# EAGLE design dash8_40cw (EAGLE 9.5.2)
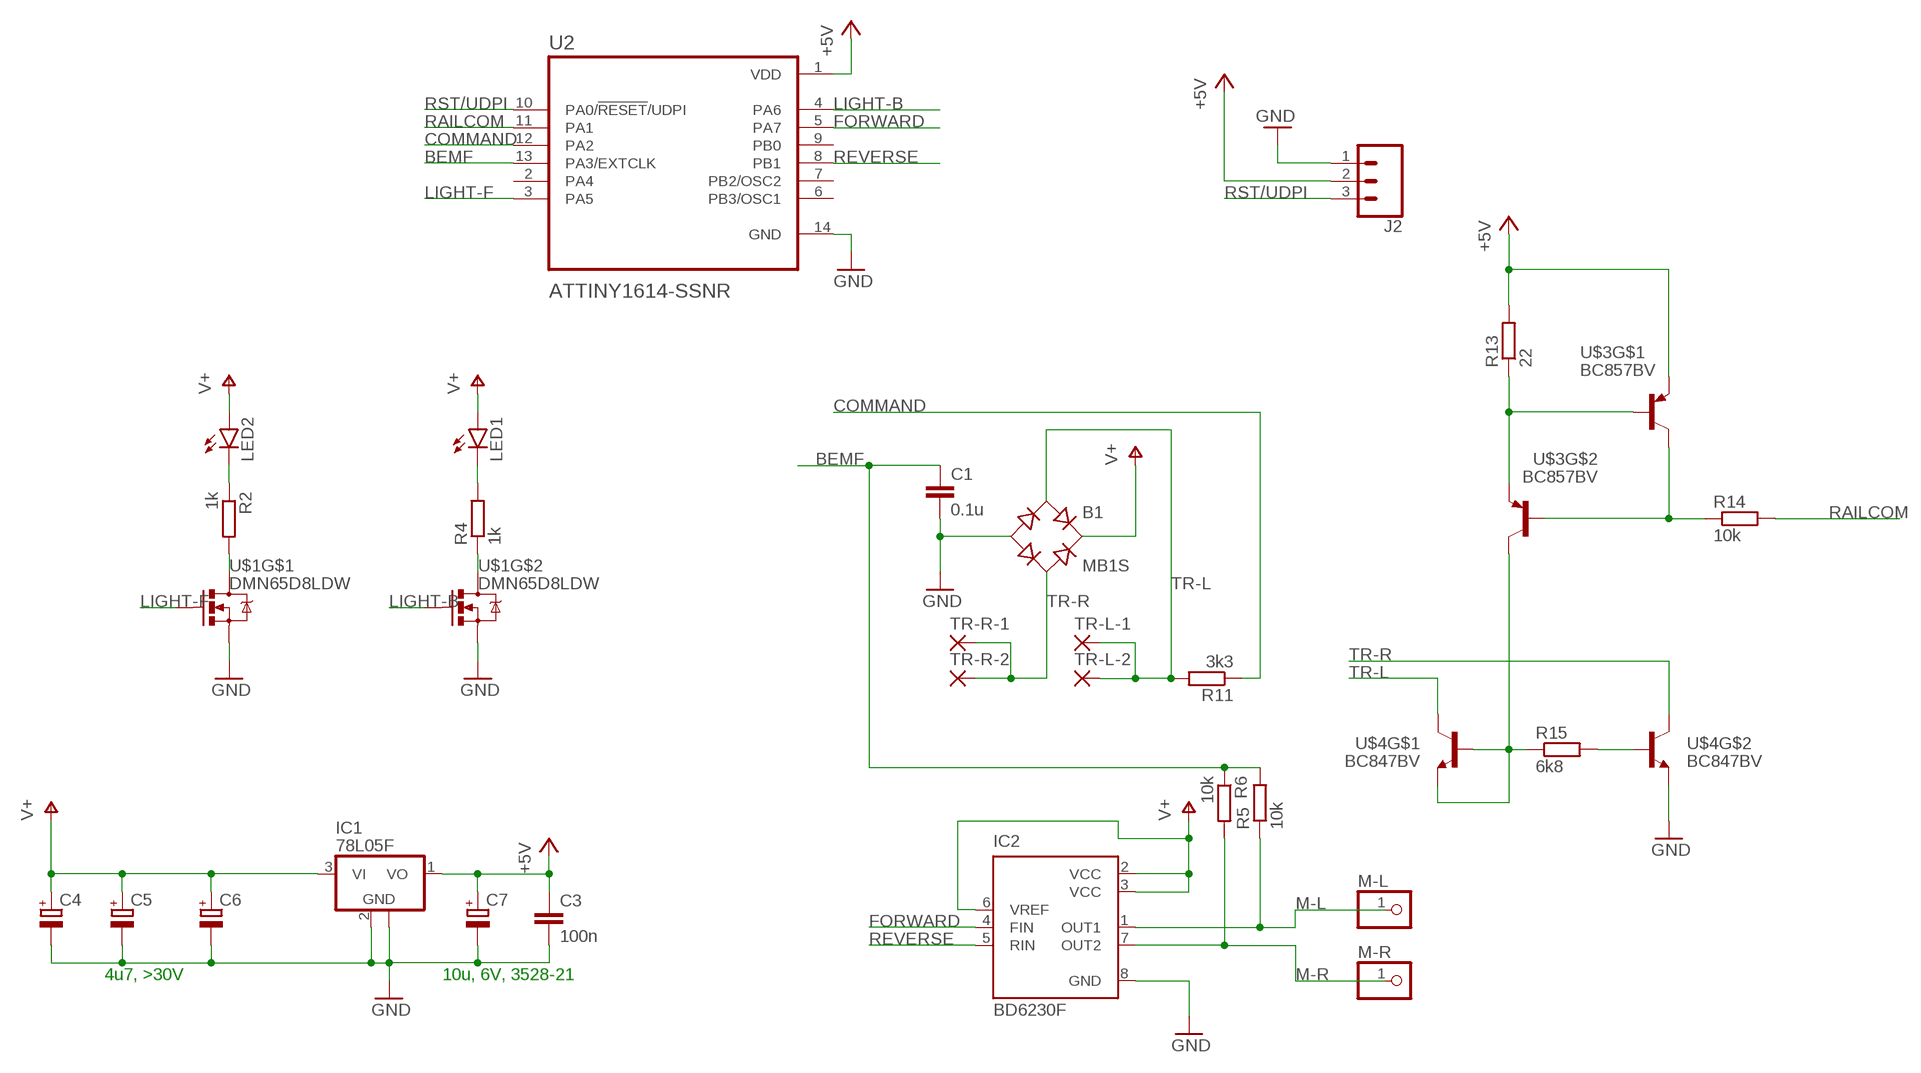
[diagram p0: schematic, sheet 1]

## Parts
B1  MB1S  [SOIC-4]
C1  0.1u  C-EUC0805  [C0805]
C3  100n  C-EUC0805  [C0805]
C4  CPOL-EUCT3528  [CT3528]
C5  CPOL-EUCT3528  [CT3528]
C6  CPOL-EUCT3528  [CT3528]
C7  CPOL-EUCT3528  [CT3528]
IC1  78L05F  [SOT89]
IC2  BD6230F  [SOP8]
J2  455-1750-1-ND  CONN_03  [1X03]
LED1  LED3MM  [LED3MM]
LED2  LED3MM  [LED3MM]
M-L  PINHD-1X1  [1X01]
M-R  PINHD-1X1  [1X01]
R2  1k  R-EU_R0603  [R0603]
R4  1k  R-EU_R0603  [R0603]
R5  10k  R-EU_R0603  [R0603]
R6  10k  R-EU_R0603  [R0603]
R11  3k3  R-EU_R0603  [R0603]
R13  22  R-EU_R0805  [R0805]
R14  10k  R-EU_R0805  [R0805]
R15  6k8  R-EU_R0805  [R0805]
TR-L-1  SMD5  [SMD2,54-5,08]
TR-L-2  SMD5  [SMD2,54-5,08]
TR-R-1  SMD5  [SMD2,54-5,08]
TR-R-2  SMD5  [SMD2,54-5,08]
U2  ATTINY1614-SSNR  [SOIC127P600X175-14N]
U$1  DMN65D8LDW  [SOT363]
U$3  BC857BV  [SOT-666]
U$4  BC847BV  [SOT-666]

## Nets
+5V: C3.1 C7.+ IC1.1(VO) J2.2 R13.2 U2.1(VDD) U$3.P$1(E)
BEMF: C1.1 R5.2 R6.1 U2.13(PA3/EXTCLK)
COMMAND: R11.1 U2.12(PA2)
FORWARD: IC2.4(FIN) U2.5(PA7)
GND: B1.- C1.2 C3.2 C4.- C5.- C6.- C7.- IC1.2(GND) IC1.2@1(GND) IC2.8(GND) J2.1 U2.14(GND) U$1.P$3(S) U$1.P$6(S) U$4.P$4(E)
LIGHT-B: U2.4(PA6) U$1.P$5(G)
LIGHT-F: U2.3(PA5) U$1.P$2(G)
M-L: IC2.1(OUT1) M-L.1 R5.1
M-R: IC2.7(OUT2) M-R.1 R6.2
N$1: LED2.K(C) R2.1
N$5: R4.1 U$1.P$1(D)
N$6: R2.2 U$1.P$4(D)
N$7: LED1.K(C) R4.2
N$18: R15.2 U$4.P$5(B)
N$19: R15.1 U$3.P$3(C) U$4.P$1(E) U$4.P$2(B)
N$20: R13.1 U$3.P$2(B) U$3.P$4(E)
N$21: R14.1 U$3.P$5(B) U$3.P$6(C)
RAILCOM: R14.2 U2.11(PA1)
REVERSE: IC2.5(RIN) U2.8(PB1)
RST/UDPI: J2.3 U2.10(PA0/!RESET!/UDPI)
TR-L: B1.~1(AC1) R11.2 TR-L-1.1(P) TR-L-2.1(P) U$4.P$6(C)
TR-R: B1.~2(AC2) TR-R-1.1(P) TR-R-2.1(P) U$4.P$3(C)
V+: B1.+ C4.+ C5.+ C6.+ IC1.3(VI) IC2.2(VCC) IC2.3(VCC) IC2.6(VREF) LED1.A LED2.A
Unconnected: U2.2(PA4) U2.6(PB3/OSC1) U2.7(PB2/OSC2) U2.9(PB0)

## Notes on the sheet
- 4u7, >30V | 10u, 6V, 3528-21

## Library data of the parts
B1 = rectifier:MB*S: Bridge Rectifier Source: http://www.fairchildsemi.com/ds/MB/MB6S.pdf
C1 = resistor:C-EU: CAPACITOR, European symbol
C3 = rcl:C-EU: CAPACITOR, European symbol; SPICEPREFIX: C
C4-C7 = rcl:CPOL-EU: POLARIZED CAPACITOR, European symbol; SPICEPREFIX: C
IC1 = linear:78L*: POSITOIV-VOLTAGE REGULATORS Output up to 100 mA Source: Datasheet <http://focus.ti.com/lit/ds/symlink/ua78l05.pdf>
IC2 = rohm:BD623*F: H-bridge driver for brush motors Source: http://www.rohm.com/products/databook/motor/pdf/bd623x_series-e.pdf; MPN: BD6230F-E2; OC_FARNELL: 1716264; OC_NEWARK: 15R0529
J2 = SparkFun-Connectors:CONN_03: Multi connection point. Often used as Generic Header-pin footprint for 0.1 inch spaced/style header connections On any of the 0.1 inch spaced packages, you can populate with these: Break Away Headers - Straight <https://www.sparkfun.com/products/116> (PRT-00116) Break Away Male Headers - Right Angle <https://www.sparkfun.com/products/553> (PRT-00553) Female Headers <https://www.sparkfun.com/products/115> (PRT-00115) Break Away Headers - Machine Pin <https://www.sparkfun.com/products/117> (PRT-00117) Break Away Female Headers - Swiss Machine Pin <https://www.sparkfun.com/products/743> (PRT-00743) Stackable Header - 3 Pin (Female, 0.1") <https://www.sparkfun.com/products/13875> (PRT-13875) For SCREWTERMINALS and SPRING TERMINALS visit here: Screw Terimnals on SparkFun.com <https://www.sparkfun.com/search/results?term=Screw+Terminals> (5mm/3.5mm/2.54mm spacing) This device is also useful as a general connection point to wire up your design to another part of your project. Our various solder wires solder well into these plated through hole pads. Hook-Up Wire - Assortment (Stranded, 22 AWG) <https://www.sparkfun.com/products/11375> (PRT-11375) Hook-Up Wire - Assortment (Solid Core, 22 AWG) <https://www.sparkfun.com/products/11367> (PRT-11367) View the entire wire category on our website here <https://www.sparkfun.com/categories/141> Special notes: Molex polarized connector foot print use with SKU : PRT-08232 with associated crimp pins and housings.; PROD_ID: XXX-00000
LED1 LED2 = led:LED: LED OSRAM: - CHIPLED LG R971, LG N971, LY N971, LG Q971, LY Q971, LO R971, LY R971 LH N974, LH R974 LS Q976, LO Q976, LY Q976 LO Q996 - Hyper CHIPLED LW Q18S LB Q993, LB Q99A, LB R99A - SideLED LS A670, LO A670, LY A670, LG A670, LP A670 LB A673, LV A673, LT A673, LW A673 LH A674 LY A675 LS A676, LA A676, LO A676, LY A676, LW A676 LS A679, LY A679, LG A679 - Hyper Micro SIDELED® LS Y876, LA Y876, LO Y876, LY Y876 LT Y87S - SmartLED LW L88C, LW L88S LB L89C, LB L89S, LG L890 LS L89K, LO L89K, LY L89K LS L896, LA L896, LO L896, LY L896 - TOPLED LS T670, LO T670, LY T670, LG T670, LP T670 LSG T670, LSP T670, LSY T670, LOP T670, LYG T670 LG T671, LOG T671, LSG T671 LB T673, LV T673, LT T673, LW T673 LH T674 LS T676, LA T676, LO T676, LY T676, LB T676, LH T676, LSB T676, LW T676 LB T67C, LV T67C, LT T67C, LS T67K, LO T67K, LY T67K, LW E67C LS E67B, LA E67B, LO E67B, LY E67B, LB E67C, LV E67C, LT E67C LW T67C LS T679, LY T679, LG T679 LS T770, LO T770, LY T770, LG T770, LP T770 LB T773, LV T773, LT T773, LW T773 LH T774 LS E675, LA E675, LY E675, LS T675 LS T776, LA T776, LO T776, LY T776, LB T776 LHGB T686 LT T68C, LB T68C - Hyper Mini TOPLED® LB M676 - Mini TOPLED Santana® LG M470 LS M47K, LO M47K, LY M47K Source: http://www.osram.convergy.de LUXEON: - LUMILED® LXK2-PW12-R00, LXK2-PW12-S00, LXK2-PW14-U00, LXK2-PW14-V00 LXK2-PM12-R00, LXK2-PM12-S00, LXK2-PM14-U00 LXK2-PE12-Q00, LXK2-PE12-R00, LXK2-PE12-S00, LXK2-PE14-T00, LXK2-PE14-U00 LXK2-PB12-K00, LXK2-PB12-L00, LXK2-PB12-M00, LXK2-PB14-N00, LXK2-PB14-P00, LXK2-PB14-Q00 LXK2-PR12-L00, LXK2-PR12-M00, LXK2-PR14-Q00, LXK2-PR14-R00 LXK2-PD12-Q00, LXK2-PD12-R00, LXK2-PD12-S00 LXK2-PH12-R00, LXK2-PH12-S00 LXK2-PL12-P00, LXK2-PL12-Q00, LXK2-PL12-R00 Source: www.luxeon.com KINGBRIGHT: KA-3528ASYC Source: www.kingbright.com
M-L M-R = adafruit:PINHD-1X1: Pin header 1x1 for 0.1" spacing With round pins
R2 R4-R6 R11 R13-R15 = rcl:R-EU_: RESISTOR, European symbol; SPICEPREFIX: R
TR-L-1 TR-L-2 TR-R-1 TR-R-2 = wirepad:SMD5: SMD PAD
U2 = ATTINY1614-SSNR:ATTINY1614-SSNR: 20MHz, SOIC, 85C, Green, 14 SOIC .150in T/R; AVAILABILITY: Unavailable; DESCRIPTION: AVR tinyAVR™ 1 Microcontroller IC 8-Bit 20MHz 16KB _16K x 8_ FLASH 14-SOIC; MF: Microchip; MP: ATTINY1614-SSNR; PACKAGE: SO-14 Microchip; PRICE: None
U$1 = Railstars:DMN65D8LDW
U$3 = Railstars:BC857BV
U$4 = Railstars:BC847BV

## Board
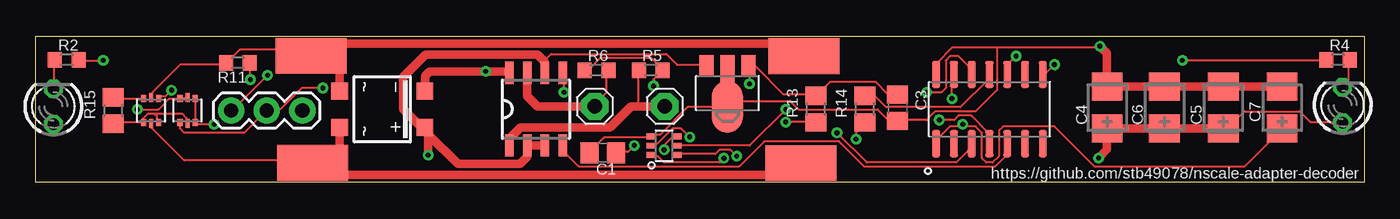
[diagram p1: board, top side]
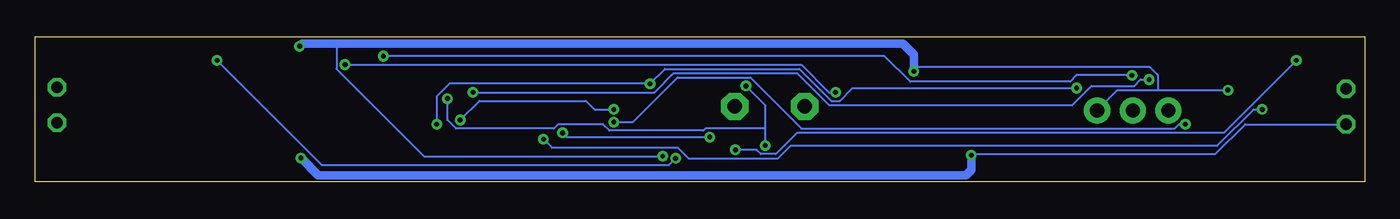
[diagram p2: board, bottom side, seen from below]

Size 95 x 10.4 mm. Coordinates in mm from the lower left corner, seen from the top.
Outline: 0,0 95,0 95,10.4 0,10.4 0,0
Copper layers (1*16): Top 0.035mm / dielectric 1.5mm / Bottom 0.035mm
Design rules "default *": minimum track width 6mil, minimum drill 0.35mm, track to track 6mil, track to pad 6mil, pad to pad 6mil, via to via 6mil, smd to smd 6mil, copper to edge 6mil, drill to drill 6mil, minimum pad ring 10mil, minimum via ring 8mil, stop-mask expansion 4mil, vias tented up to drill 0mil, thermal gap 10mil

### Footprints (pad centres in the part's own frame; a part is rotated, then mirrored left to right if it is on the bottom)
SOIC-4 = smd 1.2 x 1.2: + 1.3,3.05; - -1.3,3.05; ~1 -1.3,-3.05; ~2 1.3,-3.05
C0805 = smd 1.3 x 1.5: 1 -0.95,0; 2 0.95,0
CT3528 = smd 2 x 2.2: + -1.5,0; - 1.5,0
SOT89 = smd 1 x 1.5: 1 -1.499,-1.981; 3 1.499,-1.981 | smd 1 x 2: 2 0,-1.727 | smd 2.2 x 3.7: 2@1 0,0.94
SOP8 = smd 0.6 x 1.6: 1 -1.905,-2.6; 2 -0.635,-2.6; 3 0.635,-2.6; 4 1.905,-2.6; 5 1.905,2.6; 6 0.635,2.6; 7 -0.635,2.6; 8 -1.905,2.6
1X03 = drill 1.016 pad 1.88: 1 0,0; 2 2.54,0; 3 5.08,0
LED3MM = drill 0.813 octagon: A -1.27,0; K 1.27,0
1X01 = drill 1.016 pad 1.93 octagon: 1 0,0
R0603 = smd 1 x 1.1: 1 -0.85,0; 2 0.85,0
R0805 = smd 1.3 x 1.5: 1 -0.95,0; 2 0.95,0
SMD2,54-5,08 = smd 2.54 x 5.08: 1 0,0
SOIC127P600X175-14N = smd 1.95 x 0.59: 1 -2.48,3.81; 2 -2.48,2.54; 3 -2.48,1.27; 4 -2.48,0; 5 -2.48,-1.27; 6 -2.48,-2.54; 7 -2.48,-3.81; 8 2.48,-3.81; 9 2.48,-2.54; 10 2.48,-1.27; 11 2.48,0; 12 2.48,1.27; 13 2.48,2.54; 14 2.48,3.81
SOT363 = smd 0.42 x 0.6: P$1 -0.65,0.95; P$2 0,0.95; P$3 0.65,0.95; P$4 0.65,-0.95; P$5 0,-0.95; P$6 -0.65,-0.95
SOT-666 = smd 0.5 x 0.375: P$1 -0.85,0.537; P$2 -0.85,-0.537; P$4 0.85,-0.537; P$5 0.85,0.537 | smd 0.65 x 0.3: P$3 -0.925,0; P$6 0.925,0

### Placement (x,y rotation side)
B1  24.81,5.19 270 top
C1  40.57,2.07 180 top
C3  61.64,5.29 270 top
C4  76.6,5.3 90 top
C5  84.9,5.3 90 top
C6  80.7,5.3 90 top
C7  89.1,5.3 90 top
IC1  49.47,6.32 180 top
IC2  35.8,5.2 0 top
J2  19.1,5.1 180 top
LED1  93.44,5.49 90 top
LED2  1.32,5.39 90 top
M-L  45,5.4 0 top
M-R  40,5.4 0 top
R2  2.27,8.73 0 top
R4  93.11,8.73 0 top
R5  44,7.98 0 top
R6  40.12,7.98 0 top
R11  14.5,8.52 180 top
R13  55.8,5.2 90 top
R14  59.3,5.2 90 top
R15  5.6,5.1 90 top
TR-L-1  54.94,8.99 90 top
TR-L-2  19.74,9.01 90 top
TR-R-1  54.74,1.33 90 top
TR-R-2  19.84,1.35 90 top
U2  68.2,5.2 90 top
U$1  44.96,2.58 90 top
U$3  10.9,5.1 90 top
U$4  8.3,5.1 90 top

### Tracks (layer width: path | path; a pad name or v marks a point on that pad's centre or on a via)
+5V  (via drill 0.35)
  Top 0.152: 66.29,3.96 67.21,3.96 67.67,3.5 67.67,1.68 67.97,1.37 68.43,1.37 68.89,1.83 68.89,3.66 69.19,3.96 72.85,3.96 75.74,1.07 86.41,1.07 89,3.66 C7.+ | 66.29,3.96 65.38,3.96 64.47,3.05 64.47,2.74 U2.1 | U$3.P$1 10.36,4.12 10.36,3.81 10.67,3.5 14.94,3.5 16.46,5.03 J2.2 16.61,5.18 17.53,5.18 19.05,6.71 v20.57,6.71 | 51.05,8.23 51.51,8.23 53.49,6.25 55.78,6.25 R13.2 55.93,6.25 56.84,7.16 60.05,7.16 60.96,6.25 61.57,6.25 C3.1 | 51.05,8.23 v51.05,7.01 | 51.05,8.23 IC1.1 | v66.29,4.12 66.29,3.96
  Bottom 0.152: v20.57,6.71 36.58,6.71 37.49,5.79 38.1,5.79 40.39,8.08 49.99,8.08 v51.05,7.01 65.38,7.01 66.29,6.1 v66.29,4.12
BEMF  (via drill 0.35)
  Top 0.152: R6.1 39.32,8.08 39.62,8.08 40.39,8.84 44.04,8.84 44.81,8.08 R5.2 44.81,7.92 44.2,7.32 v44.2,6.86 | v42.82,2.59 42.37,2.13 41.6,2.13 C1.1 | v65.53,5.94 65.53,7.62 U2.13
  Bottom 0.152: 42.82,3.81 42.82,5.49 v44.2,6.86 | 42.82,3.81 v42.82,2.59 | v65.53,5.94 65.53,4.42 64.92,3.81 57.91,3.81 57.61,4.12 54.41,4.12 53.95,3.66 47.24,3.66 47.09,3.81 42.82,3.81
COMMAND  (via drill 0.35)
  Top 0.152: v15.39,7.32 15.39,8.38 R11.1 | v63.7,6.4 64.77,6.4 65.08,6.71 65.08,8.69 65.38,8.99 65.99,8.99 66.9,8.08 66.9,7.77 U2.12
  Bottom 0.152: v15.39,7.32 16,7.32 16.46,6.86 19.51,6.86 20.88,5.49 38.25,5.49 40.54,7.77 49.38,7.77 50.75,6.4 v63.7,6.4
FORWARD
  Top 0.152: IC2.4 37.8,2.59 37.8,2.13 38.86,1.07 50.29,1.07 52.12,2.9 57.45,2.9 59.28,1.07 68.58,1.07 69.34,1.83 69.34,2.59 U2.5
GND  (via drill 0.35)
  Top 0.152: C1.2 39.62,2.13 40.69,3.2 43.89,3.2 U$1.P$3 44.04,3.35 44.65,3.35 46.63,5.33 49.38,5.33 IC1.2@1 | 49.84,5.79 53.95,5.79 54.56,5.18 60.2,5.18 60.96,4.42 61.57,4.42 C3.2 61.72,4.42 63.7,4.42 64.31,5.03 67.21,5.03 68.73,6.55 68.73,9.6 | 49.84,5.79 49.53,5.49 IC1.2@1 | 49.84,5.79 49.53,6.1 49.53,7.92 IC1.2 | 49.84,5.79 IC1.2@1 | v9.75,6.55 9.3,6.1 8.84,6.1 U$4.P$4 | v50.14,1.83 49.68,2.29 48.92,2.29 48.62,1.98 46.02,1.98 U$1.P$6 | 68.73,9.6 65.53,9.6 64.47,8.53 64.47,7.77 U2.14 | v76.1,9.7 76,9.6 68.73,9.6
  Top 0.61: B1.- 27.86,7.56 28.2,7.9 v32.2,7.9 33.8,7.9 IC2.8 | C7.- C5.- C6.- C4.- 76.6,9.2 v76.1,9.7
  Bottom 0.152: 14.78,6.55 17.68,6.55 19.05,5.18 J2.1 | 14.78,6.55 v9.75,6.55 | v50.14,1.83 67.21,1.83 73.46,8.08 73.46,9.9 | 14.78,6.55 14.78,7.62 15.39,8.23 32,8.23 v32.2,7.9
  Bottom 0.61: v32.2,7.9 32.2,9.1 33,9.9 73.46,9.9 75.9,9.9 v76.1,9.7
LIGHT-B  (via drill 0.35)
  Top 0.152: v53.65,5.18 51.05,2.59 46.02,2.59 U$1.P$5 | v64.62,4.42 65.68,4.42 65.99,4.72 66.9,4.72 68.12,3.5 68.12,2.74 U2.4
  Bottom 0.152: v53.65,5.18 55.02,5.18 55.63,5.79 63.25,5.79 v64.62,4.42
LIGHT-F  (via drill 0.35)
  Top 0.152: v46.79,3.2 46.18,3.81 45.57,3.81 44.35,2.59 44.04,2.59 U$1.P$2 | v57.3,3.5 59.44,1.37 65.84,1.37 67.06,2.59 U2.3
  Bottom 0.152: v46.79,3.2 57,3.2 v57.3,3.5
M-L
  Top 0.152: 43.13,5.4 43.13,7.92 R5.1
  Top 0.61: M-L.1 43.13,5.4 42.6,5.4 41.1,3.9 34.7,3.9 33.9,3.1 IC2.1
M-R
  Top 0.152: R6.2 40.84,7.92 40.84,6.4 40.08,5.64 M-R.1
  Top 0.61: M-R.1 35.9,5.4 35.16,6.13 IC2.7
N$1
  Top 0.152: R2.1 1.37,8.69 1.37,6.71 LED2.K
N$5  (via drill 0.35)
  Top 0.152: v49.23,1.68 48.92,1.37 44.96,1.37 44.5,1.83 44.04,1.83 U$1.P$1 | v81.99,8.69 92.2,8.69 R4.1
  Bottom 0.152: v49.23,1.68 49.68,1.22 74.52,1.22 v81.99,8.69
N$6  (via drill 0.35)
  Top 0.152: v44.96,2.29 44.96,2.59 45.57,3.2 45.87,3.2 U$1.P$4 | v4.88,8.69 3.2,8.69 R2.2
  Bottom 0.152: v44.96,2.29 43.43,2.29 43.13,1.98 42.06,1.98 40.54,3.5 10.06,3.5 v4.88,8.69
N$7
  Top 0.152: R4.2 93.88,8.69 93.88,7.16 93.57,6.86 LED1.K
N$18
  Top 0.152: U$4.P$5 7.62,5.94 5.64,5.94 R15.2
N$19
  Top 0.152: 7.47,4.27 5.64,4.27 R15.1 | 7.47,4.27 7.62,4.27 U$4.P$1 | 8.53,4.88 8.69,4.72 8.69,4.27 U$4.P$2 | 8.53,4.88 8.08,4.88 7.47,4.27 | 8.53,4.88 10.52,4.88 10.82,4.57 10.82,4.27 U$3.P$3
N$20  (via drill 0.35)
  Top 0.152: U$3.P$4 11.43,4.27 U$3.P$2 11.58,4.12 v12.8,4.12 | v53.65,4.27 55.78,4.27 R13.1
  Bottom 0.152: v12.8,4.12 13.26,4.12 13.56,3.81 40.23,3.81 43.89,7.47 49.07,7.47 52.27,4.27 v53.65,4.27
N$21  (via drill 0.35)
  Top 0.152: U$3.P$6 10.82,5.94 U$3.P$5 10.21,5.94 9.6,5.94 8.84,5.18 v7.32,5.18 | v58.67,3.05 58.67,3.5 59.28,4.12 R14.1
  Bottom 0.152: v7.32,5.18 7.92,5.18 10.52,2.59 41,2.59 41.91,1.68 48.31,1.68 49.07,2.44 58.06,2.44 v58.67,3.05
RAILCOM
  Top 0.152: R14.2 59.44,6.1 60.05,6.1 60.81,5.33 66.14,5.33 68.12,7.32 68.12,7.62 U2.11
REVERSE  (via drill 0.35)
  Top 0.152: v37.8,6.4 37.8,7.77 IC2.5 | v72.85,8.38 72.08,7.62 U2.8
  Bottom 0.152: v37.8,6.4 38.25,6.4 40.23,8.38 v72.85,8.38
RST/UDPI  (via drill 0.35)
  Top 0.152: v70.1,8.99 69.49,8.38 69.49,7.77 U2.10 | v16.61,7.62 14.02,5.03 J2.3
  Bottom 0.152: v70.1,8.99 34.29,8.99 32.46,7.16 21.03,7.16 20.57,7.62 v16.61,7.62
TR-L
  Top 0.152: U$4.P$6 8.38,6.1 8.38,6.4 10.36,8.38 13.56,8.38 R11.2 13.72,8.53 14.63,9.45 19.2,9.45 19.51,9.14 TR-L-2.1
  Top 0.61: TR-L-1.1 54.03,9.9 20.63,9.9 TR-L-2.1 21.59,9.01 21.8,8.8 21.76,8.76 B1.~1
TR-R
  Top 0.152: U$4.P$3 8.38,4.12 8.38,3.81 10.67,1.52 19.66,1.52 TR-R-2.1
  Top 0.61: TR-R-1.1 53.91,0.5 20.69,0.5 TR-R-2.1 20.09,1.1 21.6,1.1 21.76,1.26 B1.~2
V+  (via drill 0.35)
  Top 0.152: 36.37,8.63 36.88,9.14 45.11,9.14 45.87,8.38 47.85,8.38 IC1.3 | LED1.A 93.42,4.27 91.14,4.27 90.37,5.03 86.41,5.03 85.19,3.81 C5.+
  Top 0.61: IC2.6 36.4,7.83 36.4,8.6 36.37,8.63 35.9,9.1 27.9,9.1 26.3,7.5 26.3,5.2 27.61,3.89 | 27.61,3.89 B1.+ | IC2.3 IC2.2 35.16,1.76 34.66,1.26 30.24,1.26 28.1,3.4 | 28.1,3.4 27.61,3.89 | C5.+ C6.+ C4.+ 76.6,2.3 v76,1.7 | v28.1,1.9 28.1,3.4
  Bottom 0.152: LED2.A 1.37,4.12 8.53,4.12 10.67,1.98 27.89,1.98 v28.1,1.9
  Bottom 0.61: v76,1.7 74.76,0.46 28.5,0.46 28.1,0.86 v28.1,1.9

### Text on the board
tNames: https://github.com/stb49078/nscale-adapter-decoder